# Altium schematic sheet SmartPlugV2.SchDoc
size A2
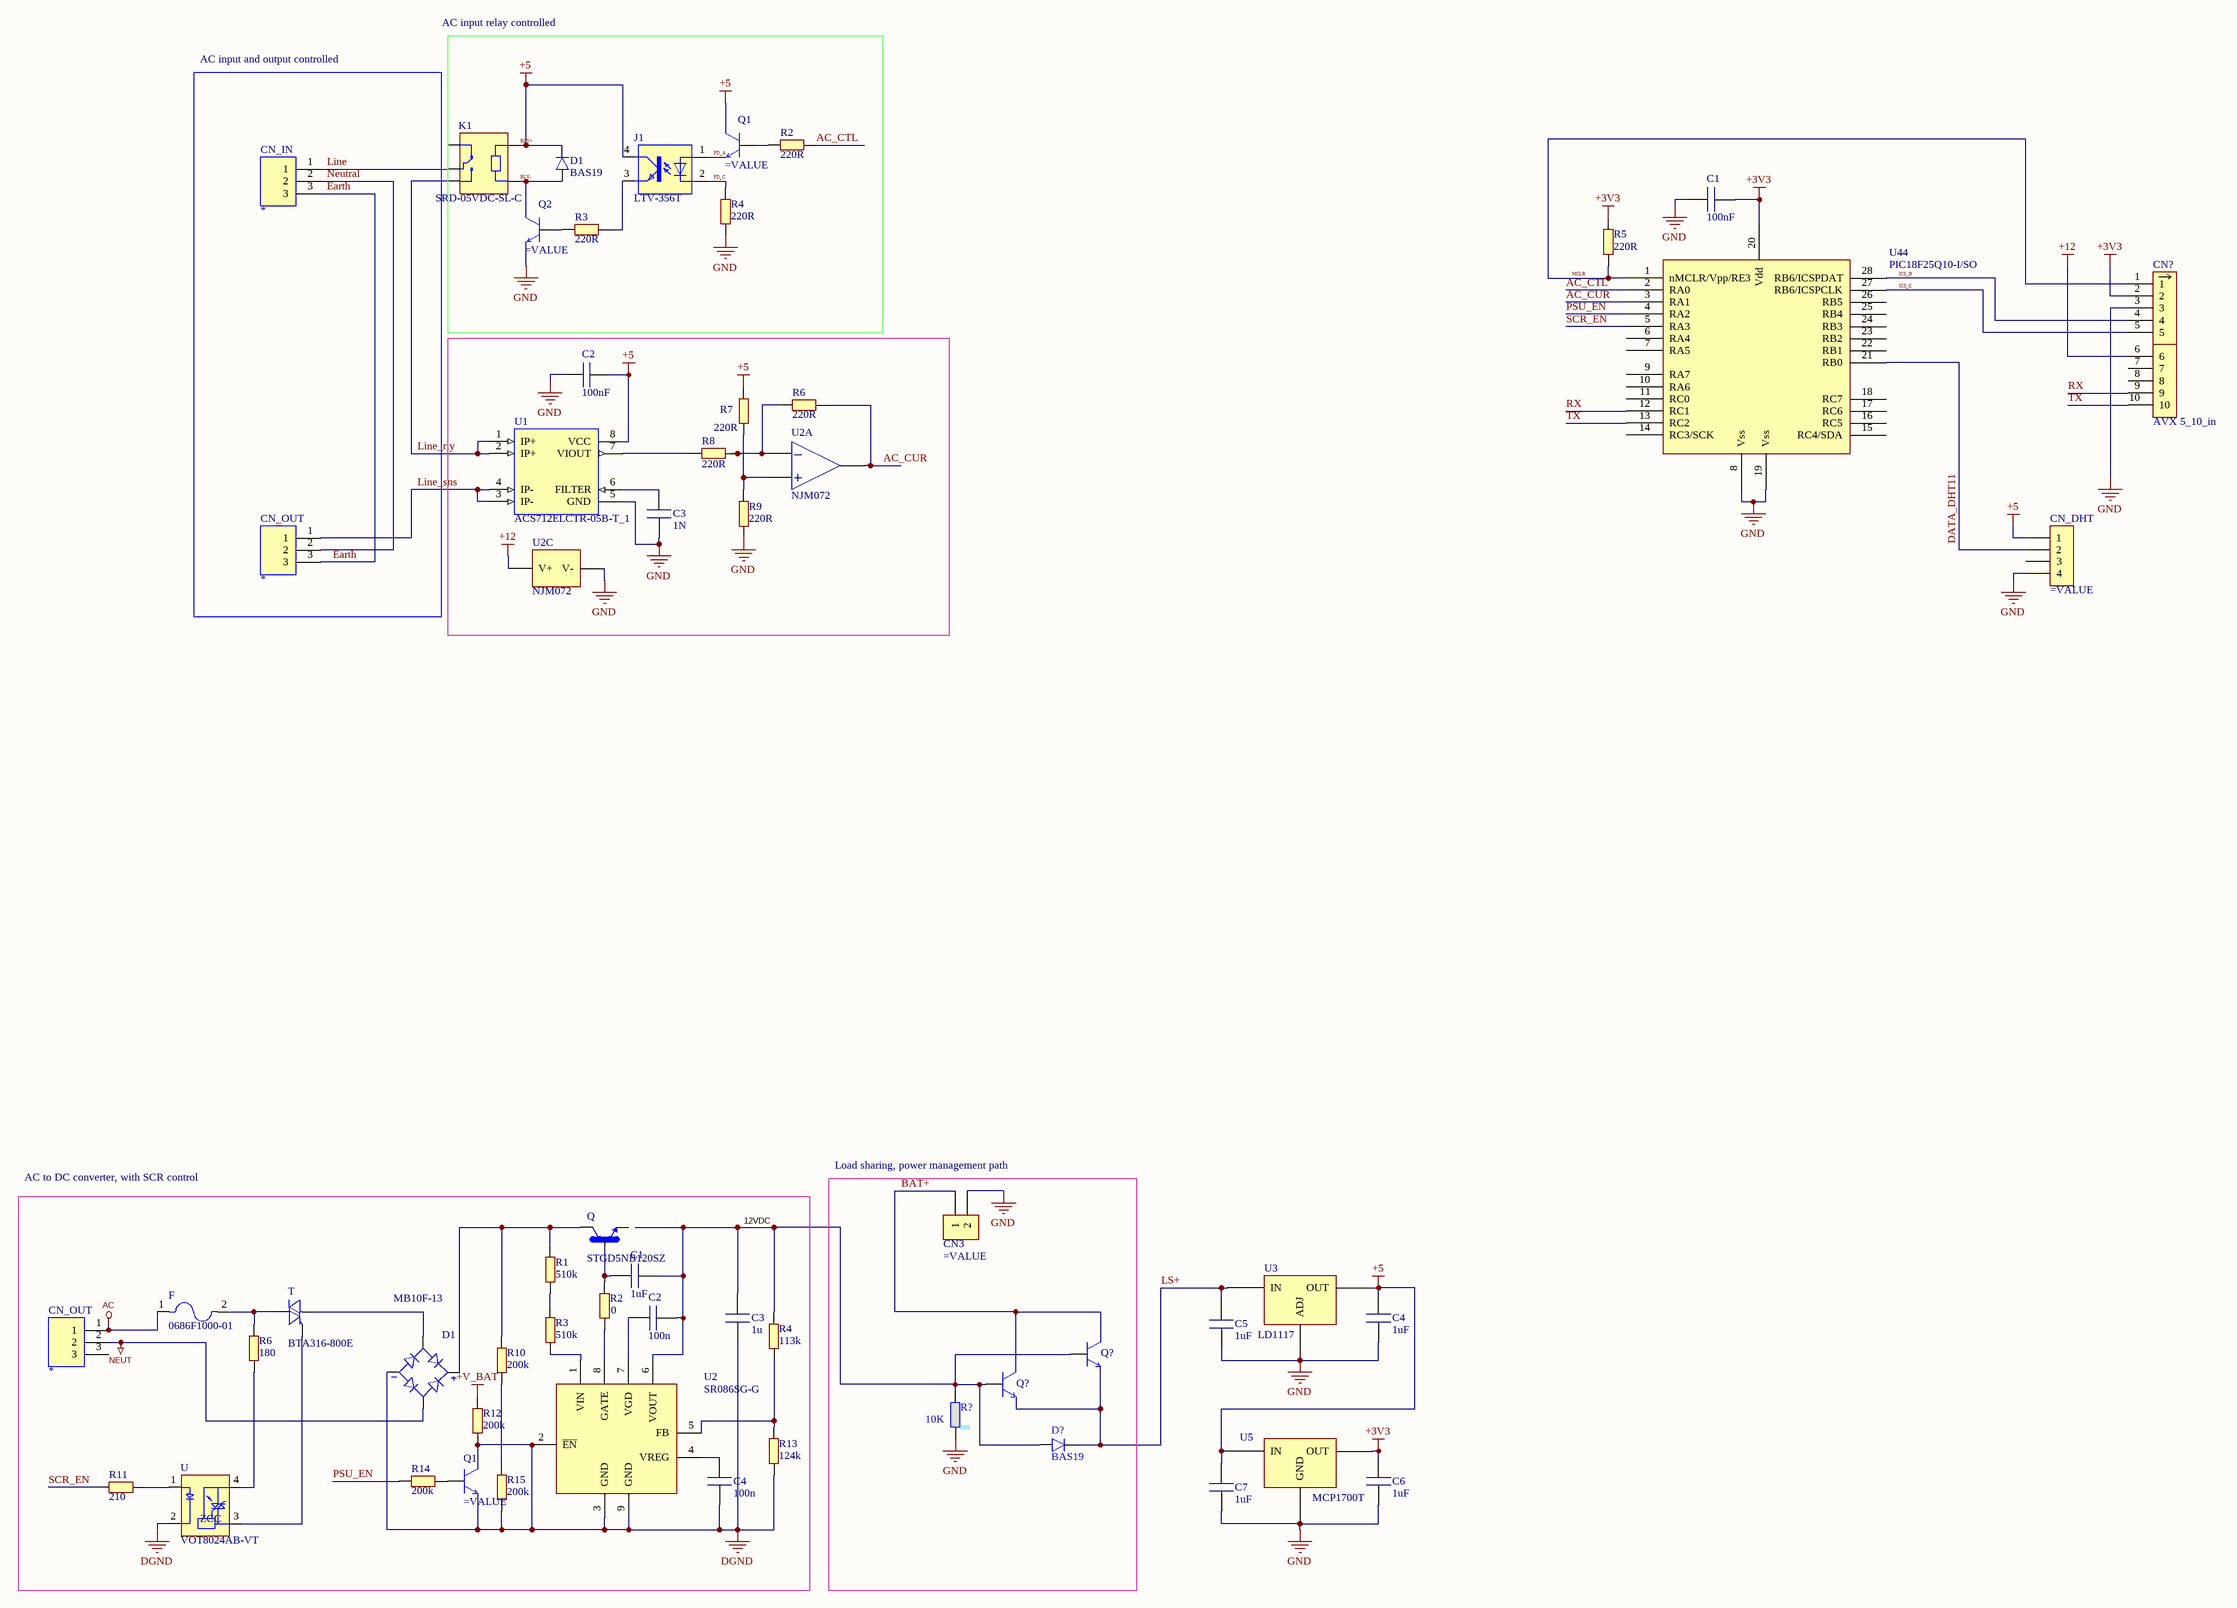
[diagram p0: SmartPlugV2.SchDoc]

## Parts
(Parts that share a designator on the sheet are numbered #1, #2 ... from top to bottom, then left to right.)
C1#1  100nF  [CAP 0603]
C1#2  1uF  [CAP 0603 1uF]
C2#1  100nF  [CAP 0603]
C2#2  100n  [CAP 0603 1uF]
C3#1  1N  [CAP 0603]
C3#2  1u  [CAP 0603 1uF]
C4#1  1uF  [CAP 0603 1uF]
C4#2  100n  [CAP 0603 1uF]
C5  1uF  [CAP 0603 1uF]
C6  1uF  [CAP 0603 1uF]
C7  1uF  [CAP 0603 1uF]
CN3  (no value)  [THT_Hdr_JST_XH_Fm_2x1_0.1_RA]
CN?  AVX 5_10_in  [AVX_10_in]
CN_DHT  (no value)  [THT_Hdr_JST_XH_Fm_4x1_0.1_RA]
CN_IN  282841-3  [TE_282841-3]  (value not drawn)
CN_OUT#1  282841-3  [TE_282841-3]  (value not drawn)
CN_OUT#2  282841-3  [TE_282841-3]  (value not drawn)
D1#1  BAS19  [SOT-23]
D1#2  MB10F-13  [DIOB_MB10F-13]
D?  BAS19  [SOT95P230X110-3N]
F  0686F1000-01  [FUSC1608X60N]
J1  LTV-356T  [MINI-FLAT-4]
K1  SRD-05VDC-SL-C  [RELAY_SRD-05VDC-SL-C]
Q  STGD5NB120SZ  [SOT78A]
Q1#1  (no value)  [[0301]BC846B_SOT23]
Q1#2  (no value)  [[0301]BC846B_SOT23]
Q2  (no value)  [[0301]BC846B_SOT23]
Q?#1  BC846A  [[0301]BC846B_SOT23]  (value not drawn)
Q?#2  BC846A  [[0301]BC846B_SOT23]  (value not drawn)
R1  510k  [RES 0603 220R]
R2#1  220R  [RES 0603 220R]
R2#2  0  [RES 0603 220R]
R3#1  220R  [RES 0603 220R]
R3#2  510k  [RES 0603 220R]
R4#1  220R  [RES 0603 220R]
R4#2  113k  [RES 0603 220R]
R5  220R  [RES 0603 220R]
R6#1  220R  [RES 0603 220R]
R6#2  180  [RES 0603 220R]
R7  220R  [RES 0603 220R]
R8  220R  [RES 0603 220R]
R9  220R  [RES 0603 220R]
R10  200k  [RES 0603 220R]
R11  210  [RES 0603 220R]
R12  200k  [RES 0603 220R]
R13  124k  [RES 0603 220R]
R14  200k  [RES 0603 220R]
R15  200k  [RES 0603 220R]
R?  10K  Footprint: 0805  [RES 0805]
T  BTA316-800E  [SOT78A]
U  VOT8024AB-VT  [SOIC254P1016X440-4N]
U1  ACS712ELCTR-05B-T_1  [SOIC127P600X175-8N]
U2#1  NJM072  [SO-8]  (parts A,C of 3)
U2#2  SR086SG-G  [EPAD-SO8]
U3  LD1117  [SOT223]
U5  MCP1700T  [SOT-23]
U44  PIC18F25Q10-I/SO  [SOIC-28]

## Blocks framed on the sheet
AC input and output controlled: CN_IN CN_OUT#1
AC to DC converter, with SCR control: C1#2 C2#2 C3#2 C4#2 CN_OUT#2 D1#2 F Q Q1#2 R1 R2#2 R3#2 R4#2 R6#2 R10-R15 T U U2#2
Load sharing, power management path: CN3 D? Q?#1 Q?#2 R?

## Nets
+3V3: C1#1.1 C6.2 CN?.2 R5.2 U5.2(OUT) U44.20(Vdd)
+12: CN?.6 U2#1.8(V+)
+V_BAT: R12.2
AC: CN_OUT#2.1 F.1
DGND: C3#2.2 C4#2.2 D1#2.3(NEG) Q1#2.2(E) Q1#2.3(C) R12.1 R13.1 R15.1 U.2(C) U2#2.2(~{EN}) U2#2.3(GND) U2#2.9(GND)
GND: C1#1.2 C2#1.2 C3#1.2 C4#1.1 C5.1 C6.1 C7.1 CN3.2 CN?.3 CN_DHT.4 Q2.2(E) R4#1.2 R9.2 R?.1 U1.5(GND) U2#1.4(V-) U3.1(ADJ) U5.1(GND) U44.8(Vss) U44.19(Vss)
NEUT: CN_OUT#2.2 D1#2.2(AC1)
RLY+: C2#1.1 C4#1.2 C7.2 CN_DHT.1 D1#1.3(K) J1.4(COL) K1.A2 Q1#1.3(C) R7.2 U1.8(VCC) U3.2(OUT) U5.3(IN)  [also labelled +5]
12VDC: C1#2.2 C2#2.1 C3#2.1 D?.1(A) Q?#1.1(B) Q?#2.1(B) R4#2.2 R?.2 U2#2.6(VOUT)
AC_CTL: R2#1.2 U44.2(RA0)
AC_CUR: R6#1.2 U2#1.1(OUTPUT) U44.3(RA1)
BAT+: CN3.1 Q?#1.3(C) Q?#2.3(C)
DATA_DHT11: CN_DHT.2 U44.21(RB0)
Earth: CN_IN.3 CN_OUT#1.3
ICS_C: CN?.5 U44.27(RB6/ICSPCLK)
ICS_D: CN?.4 U44.28(RB6/ICSPDAT)
Line: CN_IN.1 K1.COM
Line_rly: K1.NO U1.1(IP+) U1.2(IP+)
Line_sns: CN_OUT#1.1 U1.3(IP-) U1.4(IP-)
LS+: C5.2 D?.3(K) Q?#1.2(E) Q?#2.2(E) U3.3(IN)
MCLR: CN?.1 R5.1 U44.1(nMCLR/Vpp/RE3)
Neutral: CN_IN.2 CN_OUT#1.2
PD_A: J1.1(A) Q1#1.2(E)
PD_C: J1.2(C) R4#1.1
PSU_EN: R14.2 U44.4(RA2)
RLY-: D1#1.1(A) K1.A1 Q2.3(C)
RX: CN?.9 U44.12(RC1)
SCR_EN: R11.2 U44.5(RA3)
TX: CN?.10 U44.13(RC2)
NetC1#2_1: C1#2.1 Q.P$1(G) R2#2.2
NetC2#2_2: C2#2.2 U2#2.7(VGD)
NetC3#1_1: C3#1.1 U1.6(FILTER)
NetC4#2_1: C4#2.1 U2#2.4(VREG)
NetD1#2_1: D1#2.1(POS) Q.P$2(C) R1.2 R10.2
NetD1#2_4: D1#2.4(AC2) T.T1(CM)
NetF_2: F.2 R6#2.1 T.T2(LD)
NetJ1_3: J1.3(EMIT) R3#1.1
NetQ1#1_1: Q1#1.1(B) R2#1.1
NetQ1#2_1: Q1#2.1(B) R14.1
NetQ2_1: Q2.1(B) R3#1.2
NetR1_1: R1.1 R3#2.2
NetR2#2_1: R2#2.1 U2#2.8(GATE)
NetR3#2_1: R3#2.1 U2#2.1(VIN)
NetR4#2_1: R4#2.1 R13.2 U2#2.5(FB)
NetR6#1_1: R6#1.1 R8.2 U2#1.2(INV)
NetR6#2_2: R6#2.2 U.4(MT2)
NetR7_1: R7.1 R9.1 U2#1.3(NONINV)
NetR8_1: R8.1 U1.7(VIOUT)
NetR10_1: R10.1 R15.2
NetR11_1: R11.1 U.1(A)
NetT_G: T.G U.3(MT1)

Not connected (* = marked no-connect by the designer): CN? 7 8; CN_DHT 3; CN_OUT#2 3; K1 NC; Q P$3(E); U44 6(RA4) 7(RA5) 9(RA7) 10(RA6) 11(RC0) 14(RC3/SCK) 15(RC4/SDA) 16(RC5) 17(RC6) 18(RC7) 22(RB1) 23(RB2) 24(RB3) 25(RB4) 26(RB5)

## Notes on the sheet
- AC input relay controlled
- (in symbol VOT8024AB-VT) ZCC

## Library data of the parts
C1#1 C2#1 C3#1 = CAP 0603 100nF: Standard 100nF 25V 10% X7R 0603; MN: CC0603KRX7R9BB104; Value: 100nF; Footprint: 0603; Tolerance: 10%; Dielectric: X7R; Farnell: 2530141; LCSC: C14663
C1#2 C2#2 C3#2 C4#1 C4#2 C5-C7 = CAP 0603 1uF: 16V 1uF X7R ±10% 0603 MLCC; MP: CS1608X7R105K160NRB; MN: Samwha Capacitor; Value: 1uF; Footprint: 0603; Tolerance: 10%; Dielectric: X7R; LCSC: C2918499
CN3 = THT_Hdr_JST_XH_Fm_2x1_0.1_RA: JST XH Through-hole Header female 2x1 pitch 0.1'' Right angle
CN? = AVX 5_10_in: MP: 009159010061916; MF: AVX; Package: None; Price: None; Value: *; Availability: Unavailable; Mouser: 581-009159010061916; Digikey: 478-8659-ND
CN_DHT = THT_Hdr_JST_XH_Fm_4x1_0.1_RA: JST XH Through-hole Header female 4x1 pitch 0.1'' Right angle
CN_IN CN_OUT#1 CN_OUT#2 = 282841-3: Conn Terminal Block 3 POS 5.08mm Solder ST Thru-Hole 17.5A/Contact; MF: TE Connectivity; Package: None; Price: None; Check_prices: https://www.snapeda.com/parts/282841-3/TE+Connectivity+AMP+Connectors/view-part/?ref=eda; Value: *; SnapEDA_Link: https://www.snapeda.com/parts/282841-3/TE+Connectivity+AMP+Connectors/view-part/?ref=snap; MP: 282841-3; EU_RoHS_Compliance: Compliant with Exemptions; Availability: In Stock; Purchase-URL: https://pricing.snapeda.com/search?q=282841-3&ref=eda; LCSC: C474886; Comment_1: *
D1#1 = BAS19: Diode Standard 250V 200mA Surface Mount SOT-23-3 _TO-236_; MF: onsemi; MP: BAS19LT1G; Value: BAS19; SnapEDA_Link: https://www.snapeda.com/parts/BAS21/ON%20Semiconductor/view-part/2747894/?ref=snap; Price: US$0.0277; Availability: Unavailable; Package: SOT-23-3 Rectron; LCSC: C232582
D1#2 = MB10F-13: Bridge Rectifier Single Phase Standard 1 kV Surface Mount MBF; MF: Diodes Inc.; Check_prices: https://www.snapeda.com/parts/MB10F-13/Diodes+Inc./view-part/?ref=eda; Value: *; Availability: In Stock; MP: MB10F-13; Price: None; Package: SMD-4 Diodes Inc.; SnapEDA_Link: https://www.snapeda.com/parts/MB10F-13/Diodes+Inc./view-part/?ref=snap; Purchase-URL: https://pricing.snapeda.com/search/part/MB10F-13/?ref=eda
D? = BAS19: Rectifier Diode Switching 120V 0.2A 50ns Automotive 3-Pin SOT-23 T/R; UA P/N: 15-0xxx; MP: BAS19; Farnell: *; Mouser: *; RS: *; DigiKey: *; Arrow: *; Profusion: *; My_P/N: *; HelpURL: https://www.nexperia.com/products/diodes/automotive-diodes/automotive-switching-diodes/automotive-general-purpose-switching-diodes/BAS19.html; Package: SOT95P230X110-3N; Value: BAS19; ComponentLink1Description: Web MF; ComponentLink1URL: https://www.nexperia.com; ComponentLink2Description: Datasheet web; ComponentLink2URL: https://www.nexperia.com/products/diodes/automotive-diodes/automotive-switching-diodes/automotive-general-purpose-switching-diodes/BAS19.html; ComponentLink3Description: Datasheet local; ComponentLink3URL: /D/
F = 0686F1000-01: 0603 SMT Fuse | Fast Acting | 1A; MF: Bel Fuse; Mouser-Purchase-URL: https://snapeda.com/shop?store=Mouser&id=4616119; SnapEDA_Link: https://www.snapeda.com/parts/0686F1000-01/Bel%20Fuse/view-part/4616119/?ref=snap; Package: 0603 Bel Fuse Inc.; Price: None; MP: 0686F1000-01; Availability: Unavailable; Value: *
J1 = LTV-356T: Optoisolator Transistor Output 3750Vrms 1 Channel 4-SOP; MF: Lite-On Inc.; Package: SOP-4 Lite-On Inc.; Value: *; Check_prices: https://www.snapeda.com/parts/LTV-356T/Lite-On+Inc./view-part/?ref=eda; SnapEDA_Link: https://www.snapeda.com/parts/LTV-356T/Lite-On+Inc./view-part/?ref=snap; Availability: In Stock; Purchase-URL: https://pricing.snapeda.com/search/part/LTV-356T/?ref=eda; MP: LTV-356T; Price: None; LCSC: C125117
K1 = SRD-05VDC-SL-C: 5V Trigger Relay Module For Arduino And Raspberry Pi 5V Trigger Relay Module For Arduino And Raspberry Pi; MF: Songle Relay; Check_prices: https://www.snapeda.com/parts/SRD-05VDC-SL-C/Songle+Relay/view-part/?ref=eda; Value: *; Availability: Not in stock; Price: None; Package: NON STANDARD-5 Songle Relay; MP: SRD-05VDC-SL-C; SnapEDA_Link: https://www.snapeda.com/parts/SRD-05VDC-SL-C/Songle+Relay/view-part/?ref=snap; LCSC: C140615
Q = STGD5NB120SZ: IGBT 1200V 10A 75W Surface Mount DPAK; MF: STMicroelectronics; Availability: Unavailable; Price: None; Package: TO-251-3 STMicroelectronics; Value: *; SnapEDA_Link: https://www.snapeda.com/parts/STGD5NB120SZ/STMicroelectronics/view-part/2878287/?ref=snap; MP: STGD5NB120SZ
Q1#1 Q1#2 Q2 = NPN SOT-23: NPN SOT-23 transistor [0301]BC846B_SOT23
Q?#1 Q?#2 = NPN SOT-23: NPN SOT-23 transistor [0301]BC846B_SOT23; MN: Nexperia; MP: BC846A,215; Value: BC846A; LCSC: C90281; My P/N: *
R1 R2#2 R3#2 R4#2 R6#2 R10-R15 = RES0603_220R: 1/10W ±1% 220Ω ±100ppm/℃ 0603; Value: 220R; UA P/N: 13-0004; MP: CR0603F220RP05Z; MN: Ever Ohms Tech; Footprint: 0603; Type: THICK FILM; LCSC: C881327; Price: US$0.0018
R2#1 R3#1 R4#1 R5 R6#1 R7-R9 = RES0603_220R: 1/10W ±1% 220Ω ±100ppm/℃ 0603; UA P/N: 13-0004; MP: CR0603F220RP05Z; MN: Ever Ohms Tech; Value: 220R; Footprint: 0603; Type: THICK FILM; LCSC: C881327; Price: US$0.0018
R? = RES0805_NF: Standard 0805 Resistor, 5%, Thick Film; Value: NF; MF: YAGEO; MP: RC0402JR-070RL; UA P/N: 13-0xxx; LCSC: C60485; Farnell: *; Mouser: *; RS: *; DigiKey: *; Arrow: *; Profusion: *; My_P/N: *; Parameter 14: *; Package: RES 0805
T = BTA316-800E: TRIAC Logic - Sensitive Gate 800V 16A Through Hole TO-220AB; MF: WeEn Semiconductors; Availability: Unavailable; Price: None; Package: TO-220 WeEn Semiconductors; MP: BTA316-800E; Value: *; SnapEDA_Link: https://www.snapeda.com/parts/BTA316-800E/WeEn%20Semiconductors/view-part/4449646/?ref=snap
U = VOT8024AB-VT: Optoisolator Triac Output 5300Vrms 1 Channel 4-SMD; MF: Vishay Semiconductor; Price: None; Package: SMD-4 Vishay Semiconductor; Value: *; MP: VOT8024AB-VT; Availability: Unavailable; SnapEDA_Link: https://www.snapeda.com/parts/VOT8024AB-VT/Vishay%20Semiconductor%20Opto%20Division/view-part/4219083/?ref=snap
U1 = ACS712ELCTR-05B-T_1: Current Sensor 5A 1 Channel Hall Effect, Open Loop Bidirectional 8-SOIC (0.154, 3.90mm Width); MF: Allegro; SnapEDA_Link: https://www.snapeda.com/parts/ACS712ELCTR-05B-T/Allegro%20Industries/view-part/330078/?ref=snap; Availability: In Stock; Check_prices: https://www.snapeda.com/parts/ACS712ELCTR-05B-T/Allegro%20Industries/view-part/330078/?ref=eda; Value: *; Package: SOIC-8 Allegro MicroSystems LLC; MP: ACS712ELCTR-05B-T; Price: None; LCSC: C44471
U2#1 = NJM072: Dual OPAMP SOIC Package; Value: NJM072
U2#2 = SR086SG-G: T SR086SG-G _ /RADJUSTABLE OFF-LINE INDUCTORLESS SWITCHING REGULATOR | Microchip Technology Inc.; UA P/N: 15-0006; Value: SR086SG-G; Type: 36V 2.5A Buck Regulator; DigiKey PN: SR086SG-G
U3 = LD1117-3.3: LD1117STR Adjustable 1.25V-15V LDO, 800mA; UA P/N: 146-7776; Value: LD1117-3.3; Type: LDO
U5 = MCP1700T: UA P/N: 1296592; Value: MCP1700T; Type: 3V3 LDO REGULATOR
U44 = PIC18F25Q10-I/SO: PIC 18F25Q10-I/SO, SOIC 28 pins, MCU8, 16Kb flash, 1Kb RAM, 256B EEPROM; LatestRevisionDate: 17-Sep-2020; LatestRevisionNote: Created by Adrian; UA P/N: *; Value: PIC18F25Q10-I/SO; Farnell: 3380497